# EAGLE design GPS LOGGER (EAGLE 7.5.0)
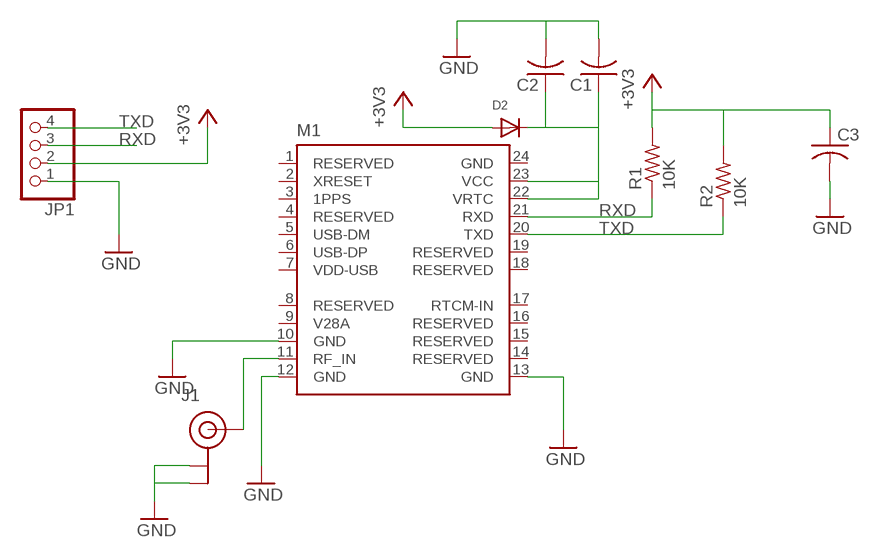
[diagram p0: schematic, sheet 1]

## Parts
C1  C-USC0805  [C0805]
C2  C-USC0805  [C0805]
C3  C-USC0805  [C0805]
D2  DIODESOD-323  [SOD-323]
J1  U.FL  [U.FL]
JP1  PINHD-1X4  [1X04]
M1  C1216_CONDOR-SMD  [1216]
R1  10K  R-US_R0805  [R0805]
R2  10K  R-US_R0805  [R0805]

## Nets
+3V3: C3.1 D2.A JP1.2 R1.2 R2.2
GND: C1.2 C2.2 C3.2 J1.P$1(GND) J1.P$2(GND) JP1.1 M1.10(GND) M1.12(GND) M1.13(GND)
N$1: J1.P$3(SIGNAL) M1.11(RF_IN)
N$2: C1.1 C2.1 D2.C M1.22(VRTC) M1.23(VCC)
RXD: JP1.3 M1.21(RXD) R1.1
TXD: JP1.4 M1.20(TXD) R2.1
Unconnected: M1.1(RESERVED) M1.2(XRESET) M1.3(1PPS) M1.4(RESERVED) M1.5(USB-DM) M1.6(USB-DP) M1.7(VDD-USB) M1.8(RESERVED) M1.9(V28A) M1.14(RESERVED) M1.15(RESERVED) M1.16(RESERVED) M1.17(RTCM-IN) M1.18(RESERVED) M1.19(RESERVED)

## Power pins joined to a net without a drawn wire
GND: M1.24(GND)

## Library data of the parts
C1-C3 = rcl:C-US: CAPACITOR, American symbol
D2 = adafruit:DIODE: Diode SMADIODE - SMA Surface Mount Package 20V 1A Schottky Diode Digikey: 641-1014-6-ND DO-1N4148 - Through Hole Small Current Diode SOD-123 20V 1 A (.5mV Vf) Schottky Diode - Digikey: MBRX120TPMSCT-ND SOD-323 10V 570mA (.38mV Vf, 3ns) Schottky Diode - Digikey: ZLLS410CT-ND SOD-523 30V 30mA Schottky Diode (RB751S-40TE61) - Digikey: RB751S-40TE61CT-ND SOT23-R/W - SOT23 Package (R = Solder Paste/Reflow Ovens, W = Hand-Soldering) BAT54Film 40V 300mA - Digikey: 497-7162-1-ND
J1 = SparkFun-Connectors:U.FL: SMD antenna connector- WRL-09144; PROD_ID: CONN-09193
JP1 = pinhead:PINHD-1X4: PIN HEADER
M1 = trimble:C1216_CONDOR: Condor C1216 GPS Receiver Module SMD GPS Receiver module, made by Trimble Navigation Ltd, Embedded Systems Group <http://www.trimble.com/embeddedsystems/> Partnumber: 68676-10 Datasheet, User Manual and Tools <http://www.trimble.com/embeddedsystems/condor-gps-module.aspx> Created by Trimble Navigation Ltd, Author: Christian Voit <mailto:christian_voit@trimble.com?subject=Trimble Eagle Library>
R1 R2 = rcl:R-US_: RESISTOR, American symbol

## Board
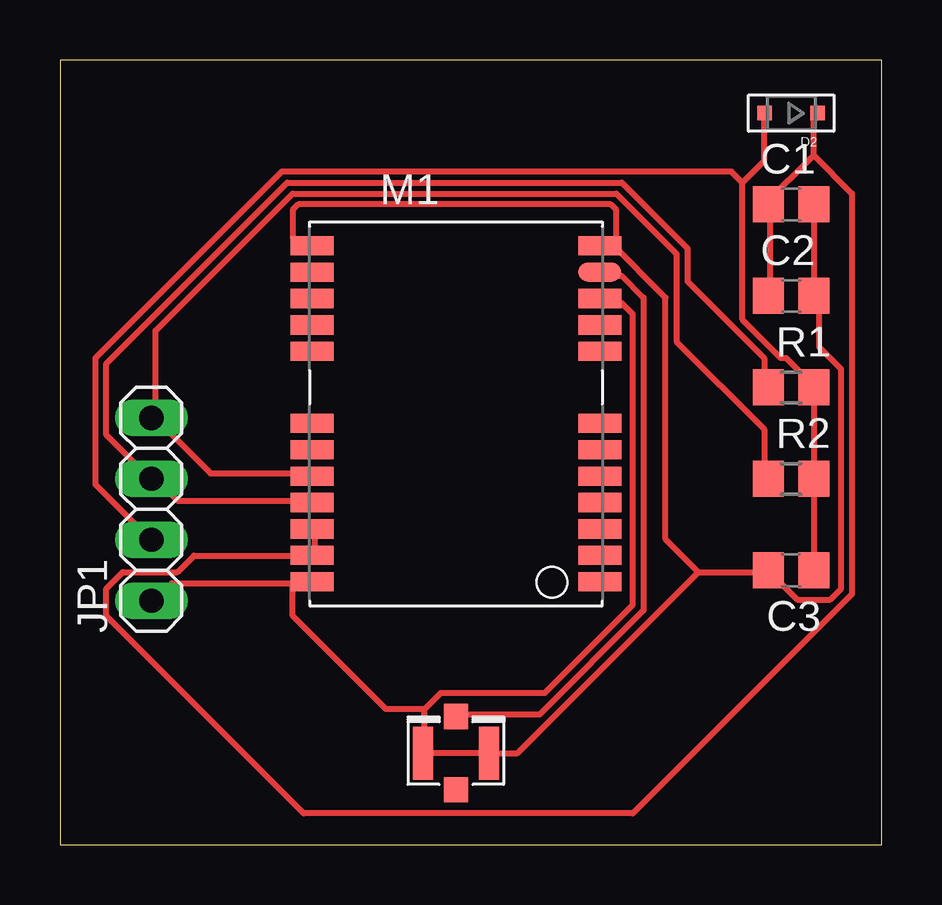
[diagram p1: board, top side]

Size 34.27 x 32.69 mm. Coordinates in mm from the lower left corner, seen from the top.
Outline: 0,0 34.27,0 34.27,32.69 0,32.69 0,0
Copper layers (1*16): Top 0.035mm / dielectric 1.5mm / Bottom 0.035mm
Design rules "default": minimum track width 10mil, minimum drill 24mil, track to track 8mil, track to pad 8mil, pad to pad 8mil, via to via 8mil, smd to smd 8mil, copper to edge 40mil, drill to drill 8mil, minimum pad ring 10mil, minimum via ring 8mil, stop-mask expansion 4mil, vias tented up to drill 0mil, thermal gap 10mil

### Footprints (pad centres in the part's own frame; a part is rotated, then mirrored left to right if it is on the bottom)
C0805 = smd 1.3 x 1.5: 1 -0.95,0; 2 0.95,0
SOD-323 = smd 0.6 x 0.6: A 1.1,0; C -1.1,0
U.FL = smd 2.2 x 0.85: P$1 0,1.375; P$2 0,-1.375 | smd 1.05 x 1: P$3 1.525,0; P$4 -1.525,0
1X04 = drill 1.016 long: 1 -3.81,0; 2 -1.27,0; 3 1.27,0; 4 3.81,0
1216 = smd 1.8 x 0.8: 1 6,-8.1; 2 6,-7; 3 6,-5.9; 4 6,-4.8; 5 6,-3.7; 6 6,-2.6; 7 6,-1.5; 8 6,1.5; 9 6,2.6; 10 6,3.7; 11 6,4.8; 12 6,5.9; 13 -6,5.9; 14 -6,4.8; 15 -6,3.7; 16 -6,2.6; 17 -6,1.5; 18 -6,-1.5; 19 -6,-2.6; 20 -6,-3.7; 21 -6,-4.8; 22 -6,-5.9; 23 -6,-7; 24 -6,-8.1
R0805 = smd 1.3 x 1.5: 1 -0.95,0; 2 0.95,0

### Placement (x,y rotation side)
C1  30.48,26.67 0 top
C2  30.48,22.86 0 top
C3  30.48,11.43 180 top
D2  30.48,30.48 180 top
J1  16.51,3.81 90 top
JP1  3.81,13.97 90 top
M1  16.51,19.05 0 top
R1  30.48,19.05 0 top
R2  30.48,15.24 0 top

### Tracks (layer width: path | path; a pad name or v marks a point on that pad's centre or on a via)
+3V3
  Top 0.254: R2.2 31.42,11.58 C3.1 | 28.45,27.58 29.36,28.5 29.36,30.33 D2.A | 28.45,27.58 28.45,21.87 30.05,20.27 30.28,20.27 31.42,19.13 R1.2 31.42,18.9 R2.2 | R2.2 | 28.45,27.58 27.99,28.04 9.25,28.04 1.47,20.27 1.47,15.01 3.76,12.72 JP1.2
GND
  Top 0.254: 9.7,10.9 4.67,10.9 3.99,10.21 JP1.1 | 9.7,10.9 10.39,10.9 M1.24 9.7,10.9 | 15.19,5.64 15.88,6.33 20.22,6.33 23.88,9.98 23.88,22.1 23.42,22.55 22.73,22.55 M1.10 | 15.19,3.81 15.19,5.64 | 9.7,10.9 9.7,9.53 13.59,5.64 15.19,5.64 | 22.96,25.07 22.73,24.84 M1.12 22.96,25.07 | 22.96,25.07 23.19,25.3 23.19,26.44 22.96,26.67 9.93,26.67 9.7,26.44 9.7,25.3 9.93,25.07 10.39,25.07 M1.13 | C1.2 31.42,23.01 C2.2 31.65,22.78 31.65,20.73 32.56,19.81 32.56,10.67 32.11,10.21 30.73,10.21 29.59,11.35 C3.2 29.36,11.35 26.62,11.35 | 26.62,11.35 19.07,3.81 J1.P$2 15.19,3.81 | 22.96,25.07 25.25,22.78 25.25,12.72 26.62,11.35 | 15.19,3.81 J1.P$1
N$1
  Top 0.254: J1.P$3 16.56,5.41 19.99,5.41 24.33,9.75 24.33,22.78 23.42,23.7 22.73,23.7 M1.11
N$2
  Top 0.254: M1.22 10.62,12.95 10.62,12.27 M1.23 10.39,12.04 5.59,12.04 4.9,11.35 2.62,11.35 1.93,10.67 1.93,9.53 10.16,1.29 23.88,1.29 33.02,10.44 33.02,27.13 31.42,28.73 | 31.42,28.73 31.42,30.33 D2.C | 31.42,28.73 29.36,26.67 C1.1 29.59,26.67 29.59,23.01 C2.1
RXD
  Top 0.254: R1.1 29.36,19.13 29.36,20.27 26.16,23.47 26.16,24.84 23.42,27.58 9.47,27.58 1.93,20.04 1.93,17.07 3.76,15.24 JP1.3 3.99,15.24 4.9,14.33 10.39,14.33 M1.21
TXD
  Top 0.254: R2.1 29.36,15.24 29.36,17.3 25.71,20.95 25.71,24.61 23.19,27.13 9.7,27.13 3.99,21.41 3.99,17.98 JP1.4 3.99,17.75 6.27,15.47 10.39,15.47 M1.20